# Altium schematic sheet BMS AFE - Cell Balancing.SchDoc: Title
size B; Organization: Midnight Sun Solar Rayce Car Team; Address1: University of Waterloo; Address2: 200 University Ave W; Address3: Waterloo, ON, Canada; Address4: N2L 3E9; DocumentNumber: 4; SheetNumber: 4; SheetTotal: 7; Website: www.uwmidsun.com; ProjectName: ProjectName
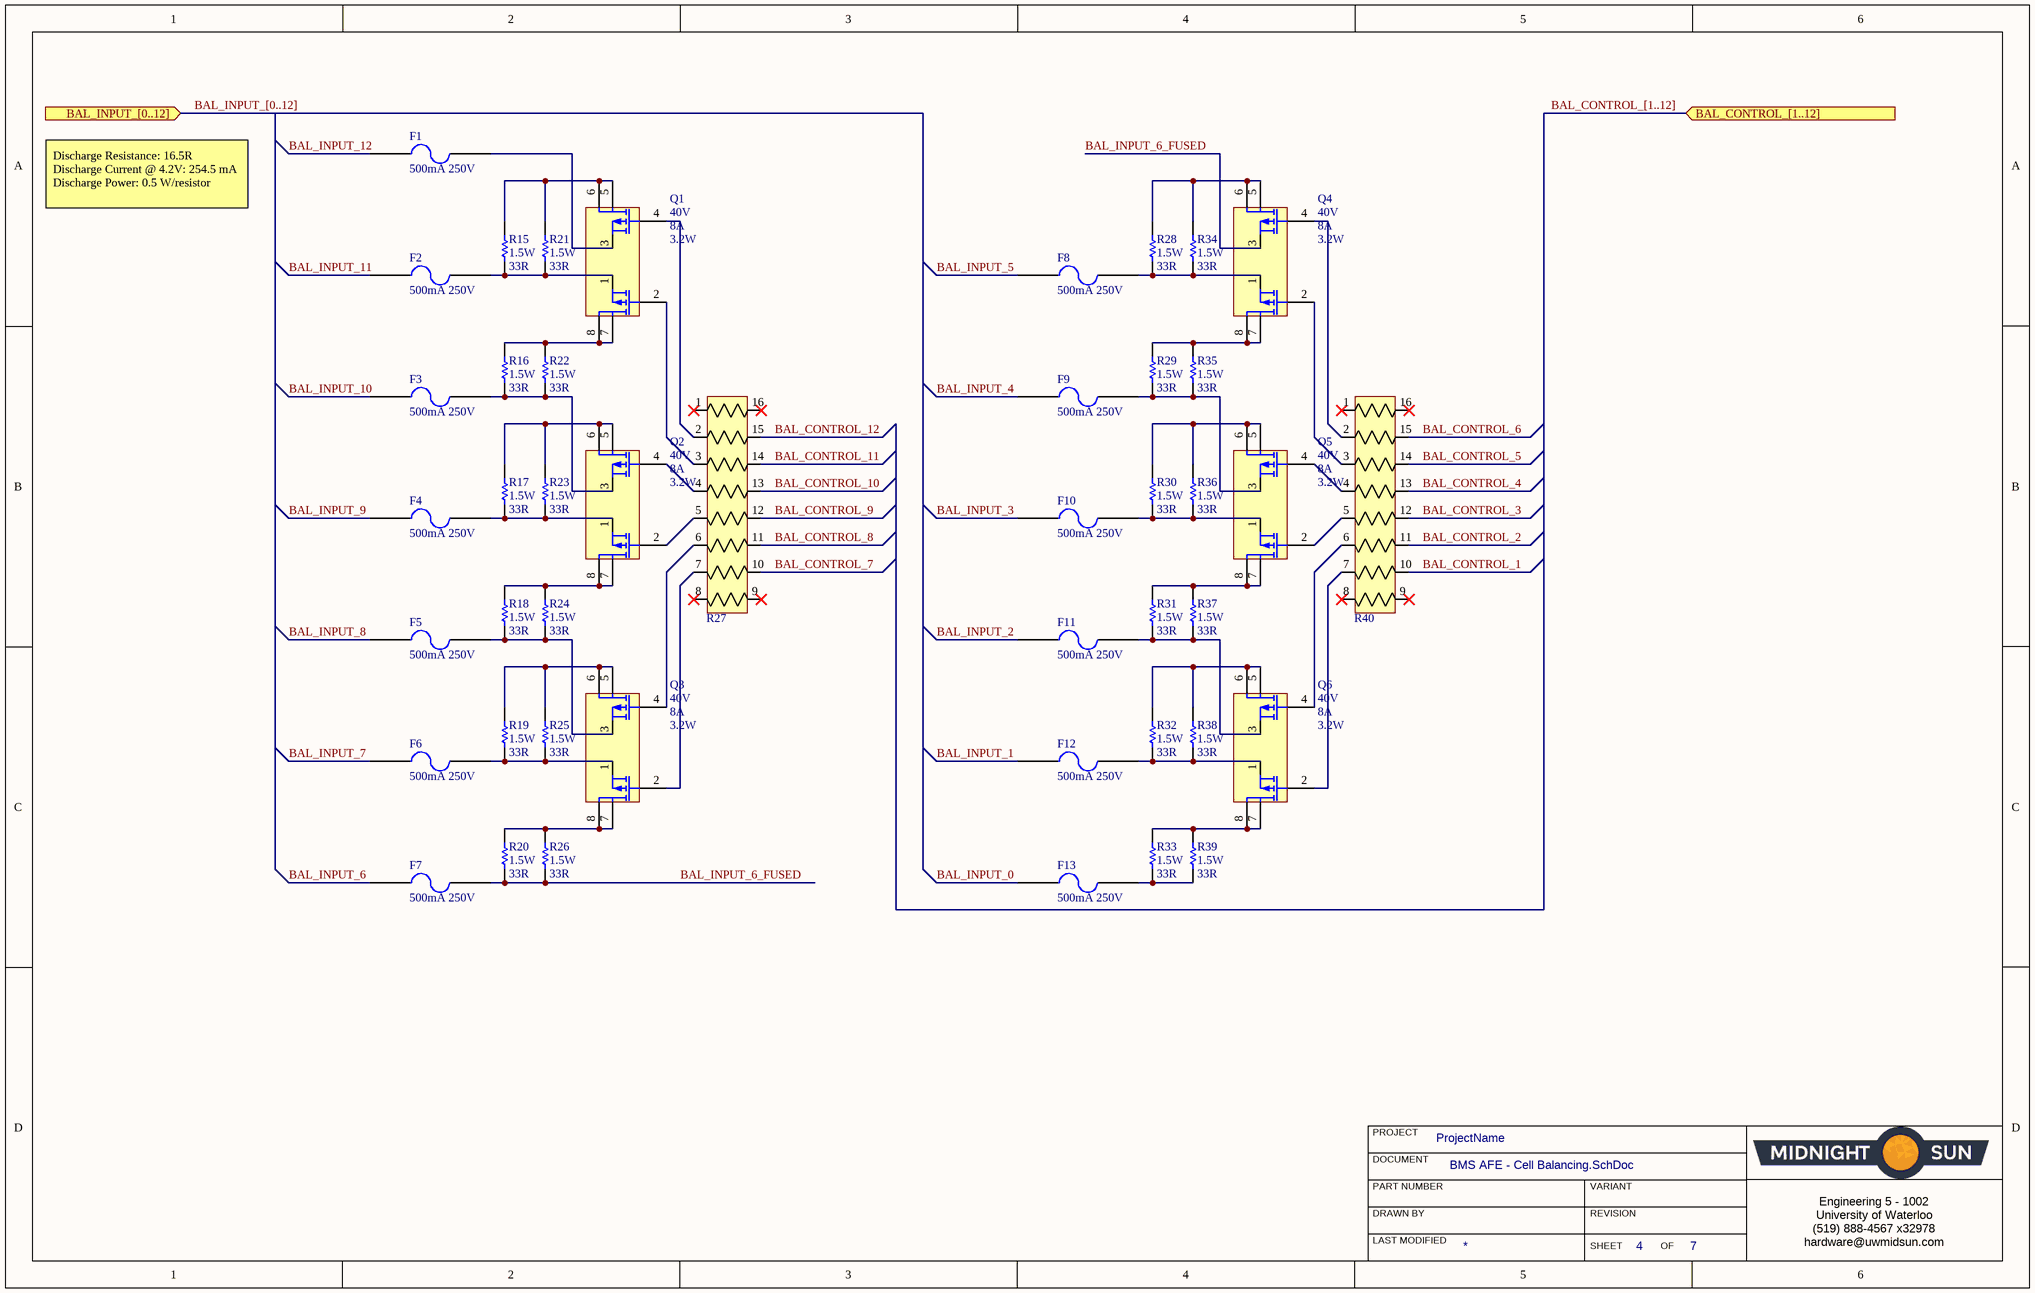
[diagram p0: BMS AFE - Cell Balancing.SchDoc]

## Parts
F1  500mA 250V  [FUSE JFC2410-0500FS]
F2  500mA 250V  [FUSE JFC2410-0500FS]
F3  500mA 250V  [FUSE JFC2410-0500FS]
F4  500mA 250V  [FUSE JFC2410-0500FS]
F5  500mA 250V  [FUSE JFC2410-0500FS]
F6  500mA 250V  [FUSE JFC2410-0500FS]
F7  500mA 250V  [FUSE JFC2410-0500FS]
F8  500mA 250V  [FUSE JFC2410-0500FS]
F9  500mA 250V  [FUSE JFC2410-0500FS]
F10  500mA 250V  [FUSE JFC2410-0500FS]
F11  500mA 250V  [FUSE JFC2410-0500FS]
F12  500mA 250V  [FUSE JFC2410-0500FS]
F13  500mA 250V  [FUSE JFC2410-0500FS]
Q1  Drain to Source Voltage (Vdss): 40V  Current - Continuous Drain (Id) @ 25°C: 8A  Power - Max: 3.2W  [SOIC8]  (hidden comment: MOSFET DUAL P-CH 40V 8A 3.2W 8-SOIC)
Q2  Drain to Source Voltage (Vdss): 40V  Current - Continuous Drain (Id) @ 25°C: 8A  Power - Max: 3.2W  [SOIC8]  (hidden comment: MOSFET DUAL P-CH 40V 8A 3.2W 8-SOIC)
Q3  Drain to Source Voltage (Vdss): 40V  Current - Continuous Drain (Id) @ 25°C: 8A  Power - Max: 3.2W  [SOIC8]  (hidden comment: MOSFET DUAL P-CH 40V 8A 3.2W 8-SOIC)
Q4  Drain to Source Voltage (Vdss): 40V  Current - Continuous Drain (Id) @ 25°C: 8A  Power - Max: 3.2W  [SOIC8]  (hidden comment: MOSFET DUAL P-CH 40V 8A 3.2W 8-SOIC)
Q5  Drain to Source Voltage (Vdss): 40V  Current - Continuous Drain (Id) @ 25°C: 8A  Power - Max: 3.2W  [SOIC8]  (hidden comment: MOSFET DUAL P-CH 40V 8A 3.2W 8-SOIC)
Q6  Drain to Source Voltage (Vdss): 40V  Current - Continuous Drain (Id) @ 25°C: 8A  Power - Max: 3.2W  [SOIC8]  (hidden comment: MOSFET DUAL P-CH 40V 8A 3.2W 8-SOIC)
R15  value 33R  Power (Watts): 1.5W  [RES STACKPOLE RPC2512 2512]  (hidden comment: RES 33 OHM 5% 1.5W 2512)
R16  value 33R  Power (Watts): 1.5W  [RES STACKPOLE RPC2512 2512]  (hidden comment: RES 33 OHM 5% 1.5W 2512)
R17  value 33R  Power (Watts): 1.5W  [RES STACKPOLE RPC2512 2512]  (hidden comment: RES 33 OHM 5% 1.5W 2512)
R18  value 33R  Power (Watts): 1.5W  [RES STACKPOLE RPC2512 2512]  (hidden comment: RES 33 OHM 5% 1.5W 2512)
R19  value 33R  Power (Watts): 1.5W  [RES STACKPOLE RPC2512 2512]  (hidden comment: RES 33 OHM 5% 1.5W 2512)
R20  value 33R  Power (Watts): 1.5W  [RES STACKPOLE RPC2512 2512]  (hidden comment: RES 33 OHM 5% 1.5W 2512)
R21  value 33R  Power (Watts): 1.5W  [RES STACKPOLE RPC2512 2512]  (hidden comment: RES 33 OHM 5% 1.5W 2512)
R22  value 33R  Power (Watts): 1.5W  [RES STACKPOLE RPC2512 2512]  (hidden comment: RES 33 OHM 5% 1.5W 2512)
R23  value 33R  Power (Watts): 1.5W  [RES STACKPOLE RPC2512 2512]  (hidden comment: RES 33 OHM 5% 1.5W 2512)
R24  value 33R  Power (Watts): 1.5W  [RES STACKPOLE RPC2512 2512]  (hidden comment: RES 33 OHM 5% 1.5W 2512)
R25  value 33R  Power (Watts): 1.5W  [RES STACKPOLE RPC2512 2512]  (hidden comment: RES 33 OHM 5% 1.5W 2512)
R26  value 33R  Power (Watts): 1.5W  [RES STACKPOLE RPC2512 2512]  (hidden comment: RES 33 OHM 5% 1.5W 2512)
R27  RES ARRAY 3.3K OHM 2% 16SOIC  [SOIC16]  (value not drawn)
R28  value 33R  Power (Watts): 1.5W  [RES STACKPOLE RPC2512 2512]  (hidden comment: RES 33 OHM 5% 1.5W 2512)
R29  value 33R  Power (Watts): 1.5W  [RES STACKPOLE RPC2512 2512]  (hidden comment: RES 33 OHM 5% 1.5W 2512)
R30  value 33R  Power (Watts): 1.5W  [RES STACKPOLE RPC2512 2512]  (hidden comment: RES 33 OHM 5% 1.5W 2512)
R31  value 33R  Power (Watts): 1.5W  [RES STACKPOLE RPC2512 2512]  (hidden comment: RES 33 OHM 5% 1.5W 2512)
R32  value 33R  Power (Watts): 1.5W  [RES STACKPOLE RPC2512 2512]  (hidden comment: RES 33 OHM 5% 1.5W 2512)
R33  value 33R  Power (Watts): 1.5W  [RES STACKPOLE RPC2512 2512]  (hidden comment: RES 33 OHM 5% 1.5W 2512)
R34  value 33R  Power (Watts): 1.5W  [RES STACKPOLE RPC2512 2512]  (hidden comment: RES 33 OHM 5% 1.5W 2512)
R35  value 33R  Power (Watts): 1.5W  [RES STACKPOLE RPC2512 2512]  (hidden comment: RES 33 OHM 5% 1.5W 2512)
R36  value 33R  Power (Watts): 1.5W  [RES STACKPOLE RPC2512 2512]  (hidden comment: RES 33 OHM 5% 1.5W 2512)
R37  value 33R  Power (Watts): 1.5W  [RES STACKPOLE RPC2512 2512]  (hidden comment: RES 33 OHM 5% 1.5W 2512)
R38  value 33R  Power (Watts): 1.5W  [RES STACKPOLE RPC2512 2512]  (hidden comment: RES 33 OHM 5% 1.5W 2512)
R39  value 33R  Power (Watts): 1.5W  [RES STACKPOLE RPC2512 2512]  (hidden comment: RES 33 OHM 5% 1.5W 2512)
R40  RES ARRAY 3.3K OHM 2% 16SOIC  [SOIC16]  (value not drawn)

## Ports
BAL_CONTROL_[1..12] (in), BAL_INPUT_[0..12] (in)

## Nets
BAL_CONTROL_1: R40.10
BAL_CONTROL_2: R40.11
BAL_CONTROL_3: R40.12
BAL_CONTROL_4: R40.13
BAL_CONTROL_5: R40.14
BAL_CONTROL_6: R40.15
BAL_CONTROL_7: R27.10
BAL_CONTROL_8: R27.11
BAL_CONTROL_9: R27.12
BAL_CONTROL_10: R27.13
BAL_CONTROL_11: R27.14
BAL_CONTROL_12: R27.15
BAL_INPUT_0: F13.1
BAL_INPUT_1: F12.1
BAL_INPUT_2: F11.1
BAL_INPUT_3: F10.1
BAL_INPUT_4: F9.1
BAL_INPUT_5: F8.1
BAL_INPUT_6: F7.1
BAL_INPUT_6_FUSED: F7.2 Q4.3(S2) R20.1 R26.1
BAL_INPUT_7: F6.1
BAL_INPUT_8: F5.1
BAL_INPUT_9: F4.1
BAL_INPUT_10: F3.1
BAL_INPUT_11: F2.1
BAL_INPUT_12: F1.1
NetF1_2: F1.2 Q1.3(S2)
NetF2_2: F2.2 Q1.1(S1) R15.1 R21.1
NetF3_2: F3.2 Q2.3(S2) R16.1 R22.1
NetF4_2: F4.2 Q2.1(S1) R17.1 R23.1
NetF5_2: F5.2 Q3.3(S2) R18.1 R24.1
NetF6_2: F6.2 Q3.1(S1) R19.1 R25.1
NetF8_2: F8.2 Q4.1(S1) R28.1 R34.1
NetF9_2: F9.2 Q5.3(S2) R29.1 R35.1
NetF10_2: F10.2 Q5.1(S1) R30.1 R36.1
NetF11_2: F11.2 Q6.3(S2) R31.1 R37.1
NetF12_2: F12.2 Q6.1(S1) R32.1 R38.1
NetF13_2: F13.2 R33.1 R39.1
NetQ1_2: Q1.2(G1) R27.3
NetQ1_4: Q1.4(G2) R27.2
NetQ1_5: Q1.5(D2) Q1.6(D2) R15.2 R21.2
NetQ1_7: Q1.7(D1) Q1.8(D1) R16.2 R22.2
NetQ2_2: Q2.2(G1) R27.5
NetQ2_4: Q2.4(G2) R27.4
NetQ2_5: Q2.5(D2) Q2.6(D2) R17.2 R23.2
NetQ2_7: Q2.7(D1) Q2.8(D1) R18.2 R24.2
NetQ3_2: Q3.2(G1) R27.7
NetQ3_4: Q3.4(G2) R27.6
NetQ3_5: Q3.5(D2) Q3.6(D2) R19.2 R25.2
NetQ3_7: Q3.7(D1) Q3.8(D1) R20.2 R26.2
NetQ4_2: Q4.2(G1) R40.3
NetQ4_4: Q4.4(G2) R40.2
NetQ4_5: Q4.5(D2) Q4.6(D2) R28.2 R34.2
NetQ4_7: Q4.7(D1) Q4.8(D1) R29.2 R35.2
NetQ5_2: Q5.2(G1) R40.5
NetQ5_4: Q5.4(G2) R40.4
NetQ5_5: Q5.5(D2) Q5.6(D2) R30.2 R36.2
NetQ5_7: Q5.7(D1) Q5.8(D1) R31.2 R37.2
NetQ6_2: Q6.2(G1) R40.7
NetQ6_4: Q6.4(G2) R40.6
NetQ6_5: Q6.5(D2) Q6.6(D2) R32.2 R38.2
NetQ6_7: Q6.7(D1) Q6.8(D1) R33.2 R39.2

Not connected (* = marked no-connect by the designer): R27 1* 8* 9* 16*; R40 1* 8* 9* 16*

## Buses and harness runs
bus BAL_CONTROL_[1..12] = port BAL_CONTROL_[1..12]
bus BAL_INPUT_[0..12] = port BAL_INPUT_[0..12]

## Notes on the sheet
- Discharge Resistance: 16.5R
  Discharge Current @ 4.2V: 254.5 mA
  Discharge Power: 0.5 W/resistor
- PROJECT
- DOCUMENT
- DRAWN BY
- LAST MODIFIED
- PART NUMBER
- REVISION
- SHEET
- VARIANT
- OF
- Engineering 5 - 1002
  University of Waterloo
  (519) 888-4567 x32978
  hardware@uwmidsun.com

## Library data of the parts
F1-F13 = FUSE 500MA LCSC: 2410 Surface Mount Fuses RoHS; Manufacturer 1: Shenzen JDT Fuse; Manufacturer Part Number 1: JFC2410-0500FS; ComponentLink1Description: Shenzhen JDT Fuse; ComponentLink1URL: https://datasheet.lcsc.com/szlcsc/1809211424_Shenzhen-JDT-Fuse-JFC2410-0500FS_C136360.pdf; Supplier 1: LCSC; Supplier Part Number 1: C136360; Pricing 1: 1=0.0591USD
Q1-Q6 = MOSFET DUAL P-CH 40V 8A 3.2W 8-SOIC: Mosfet Array 2 P-Channel (Dual) 40V 8A 3.2W Surface Mount 8-SO; Manufacturer 1: Vishay Siliconix; Manufacturer Part Number 1: SI4909DY-T1-GE3; Description 1: MOSFET 2P-CH 40V 8A 8SO; FET Feature: Logic Level Gate; Rds On (Max) @ Id, Vgs: 27 mOhm @ 8A, 10V; Vgs(th) (Max) @ Id: 2.5V @ 250µA; Gate Charge (Qg) (Max) @ Vgs: 63nC @ 10V; Input Capacitance (Ciss) (Max) @ Vds: 2000pF @ 20V; Supplier 1: Digi-Key; Supplier Part Number 1: SI4909DY-T1-GE3CT-ND; RoHS: RoHS Compliant; Category: Discrete Semiconductor Products; Stock 1: 11582; Pricing 1: 1=1.57, 10=1.407, 25=1.3352, 100=1.0969, 250=1.02536, 500=0.90614, 1000=0.71538 (CAD); Packaging: Cut Tape (CT); Part Status: Active; FET Type: 2 P-Channel (Dual); Operating Temperature: -55°C ~ 150°C (TJ); Mounting Type: Surface Mount; Package / Case: 8-SOIC (0.154", 3.90mm Width); Supplier Device Package: 8-SO; ComponentLink1URL: http://www.vishay.com/docs/67077/si4909dy.pdf; ComponentLink1Description: http://www.vishay.com/docs/67077/si4909dy.pdf
R15-R26 R28-R39 = RES 33 OHM 5% 1.5W 2512: 33 Ohms ±5% 1.5W Chip Resistor 2512 (6432 Metric) Automotive AEC-Q200, Pulse Withstanding Thick Film; Manufacturer: Stackpole Electronics Inc.; Manufacturer Part Number: RPC2512JT33R0; Temperature Coefficient: ±100ppm/°C; Supplier 1: Digi-Key; RoHS: RoHS Compliant; Category: Resistors; Stock 1: 28556; Pricing 1: 1=0.88, 10=0.632, 100=0.3284, 1000=0.17685 (CAD); Packaging: Cut Tape (CT); Part Status: Active; Composition: Thick Film; Features: Automotive AEC-Q200, Pulse Withstanding; Operating Temperature: -55°C ~ 155°C; Package / Case: 2512 (6432 Metric); Supplier Device Package: 2512; Size / Dimension: 0.250" L x 0.122" W (6.35mm x 3.10mm); Height - Seated (Max): 0.026" (0.65mm); Failure Rate: -; ComponentLink1URL: https://www.seielect.com/Catalog/SEI-rpc.pdf; ComponentLink1Description: https://www.seielect.com/Catalog/SEI-rpc.pdf; Supplier Part Number 1: RPC2512JT33R0CT-ND; Tolerance: ±5%
R27 R40 = RES ARRAY 3.3K OHM 2% 16SOIC: 3.3k Ohm ±2% 160mW Power Per Element Isolated  Resistor Network/Array ±100ppm/°C 16-SOIC (0.220", 5.59mm Width); Manufacturer: Bourns; Manufacturer Part Number: 4816P-1-332LF; Resistance: 3.3kR; Power Rating: 1.28W; Number of Resistors: 8; Voltage Rating (DC): 50V; Mount: Surface Mount; Case/Package: SOIC; Number of Pins: 16; Number of Terminals: 16; Min Operating Temperature: -55°C; Max Operating Temperature: 125°C; Packaging: Tape and Reel; Tolerance: 2%; Package Quantity: 1; Circuit Type: Isolated; Power Per Element: 160mW; Termination: Gull Wing; Military Standard: Not; Temperature Coefficient: 100ppm/°C; Length: 0.44inch; Height: 0.085inch; Width: 0.22inch; Lead Pitch: 1.27mm; Terminal Pitch: 1.27mm; Depth: 7.62mm; Radiation Hardening: No; ComponentLink1URL: https://datasheet.ciiva.com/6494/4800p-6494310.pdf?src-supplier=Digi-Key; ComponentLink1Description: https://datasheet.ciiva.com/6494/4800p-6494310.pdf?src-supplier=Digi-Key; ComponentLink2URL: https://datasheet.ciiva.com/6494/4800p-6494312.pdf?src-supplier=Digi-Key; ComponentLink2Description: https://datasheet.ciiva.com/6494/4800p-6494312.pdf?src-supplier=Digi-Key; ComponentLink3URL: https://datasheet.ciiva.com/16826/4800p-16826713.pdf?src-supplier=Avnet+Europe; ComponentLink3Description: https://datasheet.ciiva.com/16826/4800p-16826713.pdf?src-supplier=Avnet+Europe; ComponentLink4URL: https://datasheet.ciiva.com/6494/4800p-6494315.pdf?src-supplier=Digi-Key; ComponentLink4Description: https://datasheet.ciiva.com/6494/4800p-6494315.pdf?src-supplier=Digi-Key; ComponentLink5URL: https://datasheet.ciiva.com/8370/4800p-8370733.pdf?src-supplier=Avnet; ComponentLink5Description: https://datasheet.ciiva.com/8370/4800p-8370733.pdf?src-supplier=Avnet; Pricing 1: 1=1.31000, 10=1.15900, 25=1.06600, 50=0.97240, 100=0.84150, 250=0.71060, 500=0.59840, 1000=0.49742 (USD); RoHS: Yes; Stock 1: 3189; Supplier 1: Digi-Key; Supplier Part Number 1: 4816P-1-332LFCT-ND